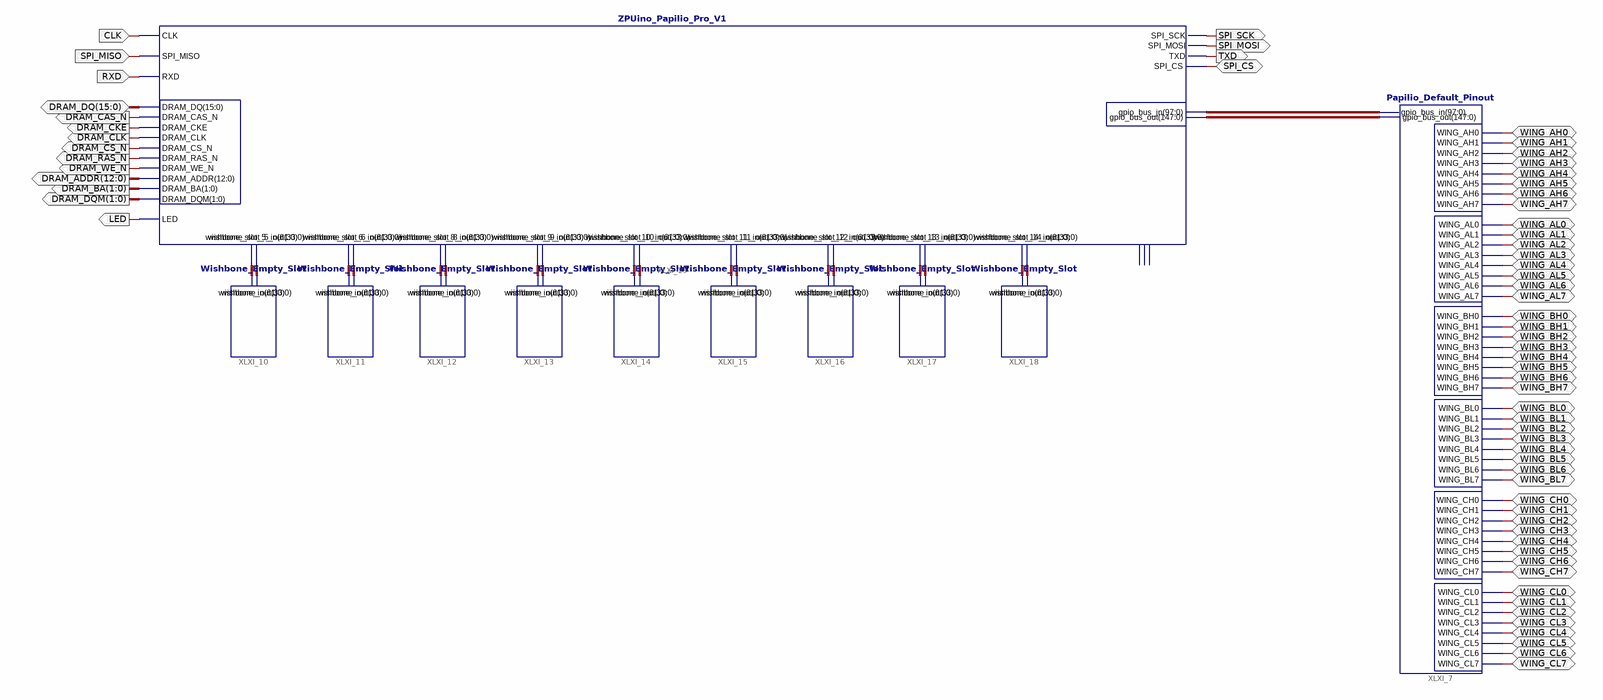
[diagram p0: schematic sheet 1]
// Xilinx ISE schematic Papilio_SOC_Base.sch (spartan6) as structural Verilog: 11 symbols, 66 ports
module Papilio_SOC_Base (
  input  CLK,
  input  SPI_MISO,
  input  RXD,
  inout  [15:0] DRAM_DQ,
  inout  SPI_CS,
  inout  WING_AH0,
  inout  WING_AH1,
  inout  WING_AH2,
  inout  WING_AH3,
  inout  WING_AH4,
  inout  WING_AH5,
  inout  WING_AH6,
  inout  WING_AH7,
  inout  WING_AL0,
  inout  WING_AL1,
  inout  WING_AL2,
  inout  WING_AL3,
  inout  WING_AL4,
  inout  WING_AL5,
  inout  WING_AL6,
  inout  WING_AL7,
  inout  WING_BH0,
  inout  WING_BH1,
  inout  WING_BH2,
  inout  WING_BH3,
  inout  WING_BH4,
  inout  WING_BH5,
  inout  WING_BH6,
  inout  WING_BH7,
  inout  WING_BL0,
  inout  WING_BL1,
  inout  WING_BL2,
  inout  WING_BL3,
  inout  WING_BL4,
  inout  WING_BL5,
  inout  WING_BL6,
  inout  WING_BL7,
  inout  WING_CH0,
  inout  WING_CH1,
  inout  WING_CH2,
  inout  WING_CH3,
  inout  WING_CH4,
  inout  WING_CH5,
  inout  WING_CH6,
  inout  WING_CH7,
  inout  WING_CL0,
  inout  WING_CL1,
  inout  WING_CL2,
  inout  WING_CL3,
  inout  WING_CL4,
  inout  WING_CL5,
  inout  WING_CL6,
  inout  WING_CL7,
  output LED,
  output [1:0] DRAM_DQM,
  output [1:0] DRAM_BA,
  output [12:0] DRAM_ADDR,
  output DRAM_WE_N,
  output DRAM_RAS_N,
  output DRAM_CS_N,
  output DRAM_CLK,
  output DRAM_CKE,
  output DRAM_CAS_N,
  output SPI_SCK,
  output SPI_MOSI,
  output TXD
);

  wire [33:0] XLXN_259, XLXN_261, XLXN_263, XLXN_265, XLXN_267, XLXN_269, XLXN_271, XLXN_273, XLXN_275;
  wire [61:0] XLXN_258, XLXN_260, XLXN_262, XLXN_264, XLXN_266, XLXN_268, XLXN_270, XLXN_272, XLXN_274;
  wire [97:0] XLXN_64;
  wire [147:0] XLXN_63;

  Papilio_Default_Pinout XLXI_7 (
    .WING_AH0(WING_AH0), .gpio_bus_out(XLXN_63), .gpio_bus_in(XLXN_64), .WING_AH1(WING_AH1),
    .WING_AH2(WING_AH2), .WING_AH3(WING_AH3), .WING_AH4(WING_AH4), .WING_AH5(WING_AH5), .WING_AH6(WING_AH6),
    .WING_AH7(WING_AH7), .WING_AL0(WING_AL0), .WING_AL1(WING_AL1), .WING_AL2(WING_AL2), .WING_AL3(WING_AL3),
    .WING_AL4(WING_AL4), .WING_AL5(WING_AL5), .WING_AL6(WING_AL6), .WING_AL7(WING_AL7), .WING_BH0(WING_BH0),
    .WING_BH1(WING_BH1), .WING_BH2(WING_BH2), .WING_BH3(WING_BH3), .WING_BH4(WING_BH4), .WING_BH5(WING_BH5),
    .WING_BH6(WING_BH6), .WING_BH7(WING_BH7), .WING_BL0(WING_BL0), .WING_BL1(WING_BL1), .WING_BL2(WING_BL2),
    .WING_BL3(WING_BL3), .WING_BL4(WING_BL4), .WING_BL5(WING_BL5), .WING_BL6(WING_BL6), .WING_BL7(WING_BL7),
    .WING_CH0(WING_CH0), .WING_CH1(WING_CH1), .WING_CH2(WING_CH2), .WING_CH3(WING_CH3), .WING_CH4(WING_CH4),
    .WING_CH5(WING_CH5), .WING_CH6(WING_CH6), .WING_CH7(WING_CH7), .WING_CL0(WING_CL0), .WING_CL1(WING_CL1),
    .WING_CL2(WING_CL2), .WING_CL3(WING_CL3), .WING_CL4(WING_CL4), .WING_CL5(WING_CL5), .WING_CL6(WING_CL6),
    .WING_CL7(WING_CL7));
  Wishbone_Empty_Slot XLXI_10 (.wishbone_in(XLXN_258), .wishbone_out(XLXN_259));
  Wishbone_Empty_Slot XLXI_11 (.wishbone_in(XLXN_260), .wishbone_out(XLXN_261));
  Wishbone_Empty_Slot XLXI_12 (.wishbone_in(XLXN_262), .wishbone_out(XLXN_263));
  Wishbone_Empty_Slot XLXI_13 (.wishbone_in(XLXN_264), .wishbone_out(XLXN_265));
  Wishbone_Empty_Slot XLXI_14 (.wishbone_in(XLXN_266), .wishbone_out(XLXN_267));
  Wishbone_Empty_Slot XLXI_15 (.wishbone_in(XLXN_268), .wishbone_out(XLXN_269));
  Wishbone_Empty_Slot XLXI_16 (.wishbone_in(XLXN_270), .wishbone_out(XLXN_271));
  Wishbone_Empty_Slot XLXI_17 (.wishbone_in(XLXN_272), .wishbone_out(XLXN_273));
  Wishbone_Empty_Slot XLXI_18 (.wishbone_in(XLXN_274), .wishbone_out(XLXN_275));
  ZPUino_Papilio_Pro_V1 XLXI_19 (
    .gpio_bus_out(XLXN_63), .gpio_bus_in(XLXN_64), .DRAM_DQ(DRAM_DQ), .LED(LED), .DRAM_CAS_N(DRAM_CAS_N),
    .DRAM_CKE(DRAM_CKE), .DRAM_CLK(DRAM_CLK), .DRAM_CS_N(DRAM_CS_N), .DRAM_RAS_N(DRAM_RAS_N),
    .DRAM_WE_N(DRAM_WE_N), .DRAM_ADDR(DRAM_ADDR), .DRAM_BA(DRAM_BA), .DRAM_DQM(DRAM_DQM),
    .wishbone_slot_8_in(XLXN_262), .wishbone_slot_8_out(XLXN_263), .wishbone_slot_9_in(XLXN_264),
    .wishbone_slot_9_out(XLXN_265), .wishbone_slot_10_in(XLXN_266), .wishbone_slot_10_out(XLXN_267),
    .wishbone_slot_11_in(XLXN_268), .wishbone_slot_11_out(XLXN_269), .wishbone_slot_12_in(XLXN_270),
    .wishbone_slot_12_out(XLXN_271), .wishbone_slot_13_in(XLXN_272), .wishbone_slot_13_out(XLXN_273),
    .wishbone_slot_14_in(XLXN_274), .wishbone_slot_14_out(XLXN_275), .wishbone_slot_5_out(XLXN_259),
    .wishbone_slot_5_in(XLXN_258), .wishbone_slot_6_in(XLXN_260), .wishbone_slot_6_out(XLXN_261),
    .SPI_CS(SPI_CS), .TXD(TXD), .SPI_MOSI(SPI_MOSI), .SPI_SCK(SPI_SCK), .CLK(CLK), .SPI_MISO(SPI_MISO),
    .RXD(RXD));  // open: wishbone_slot_video_in, wishbone_slot_video_out, vgaclkout
endmodule
